# EAGLE design Lora GPS Shield v1.3 (EAGLE 7.5.0)

## Sheet 1 of 2
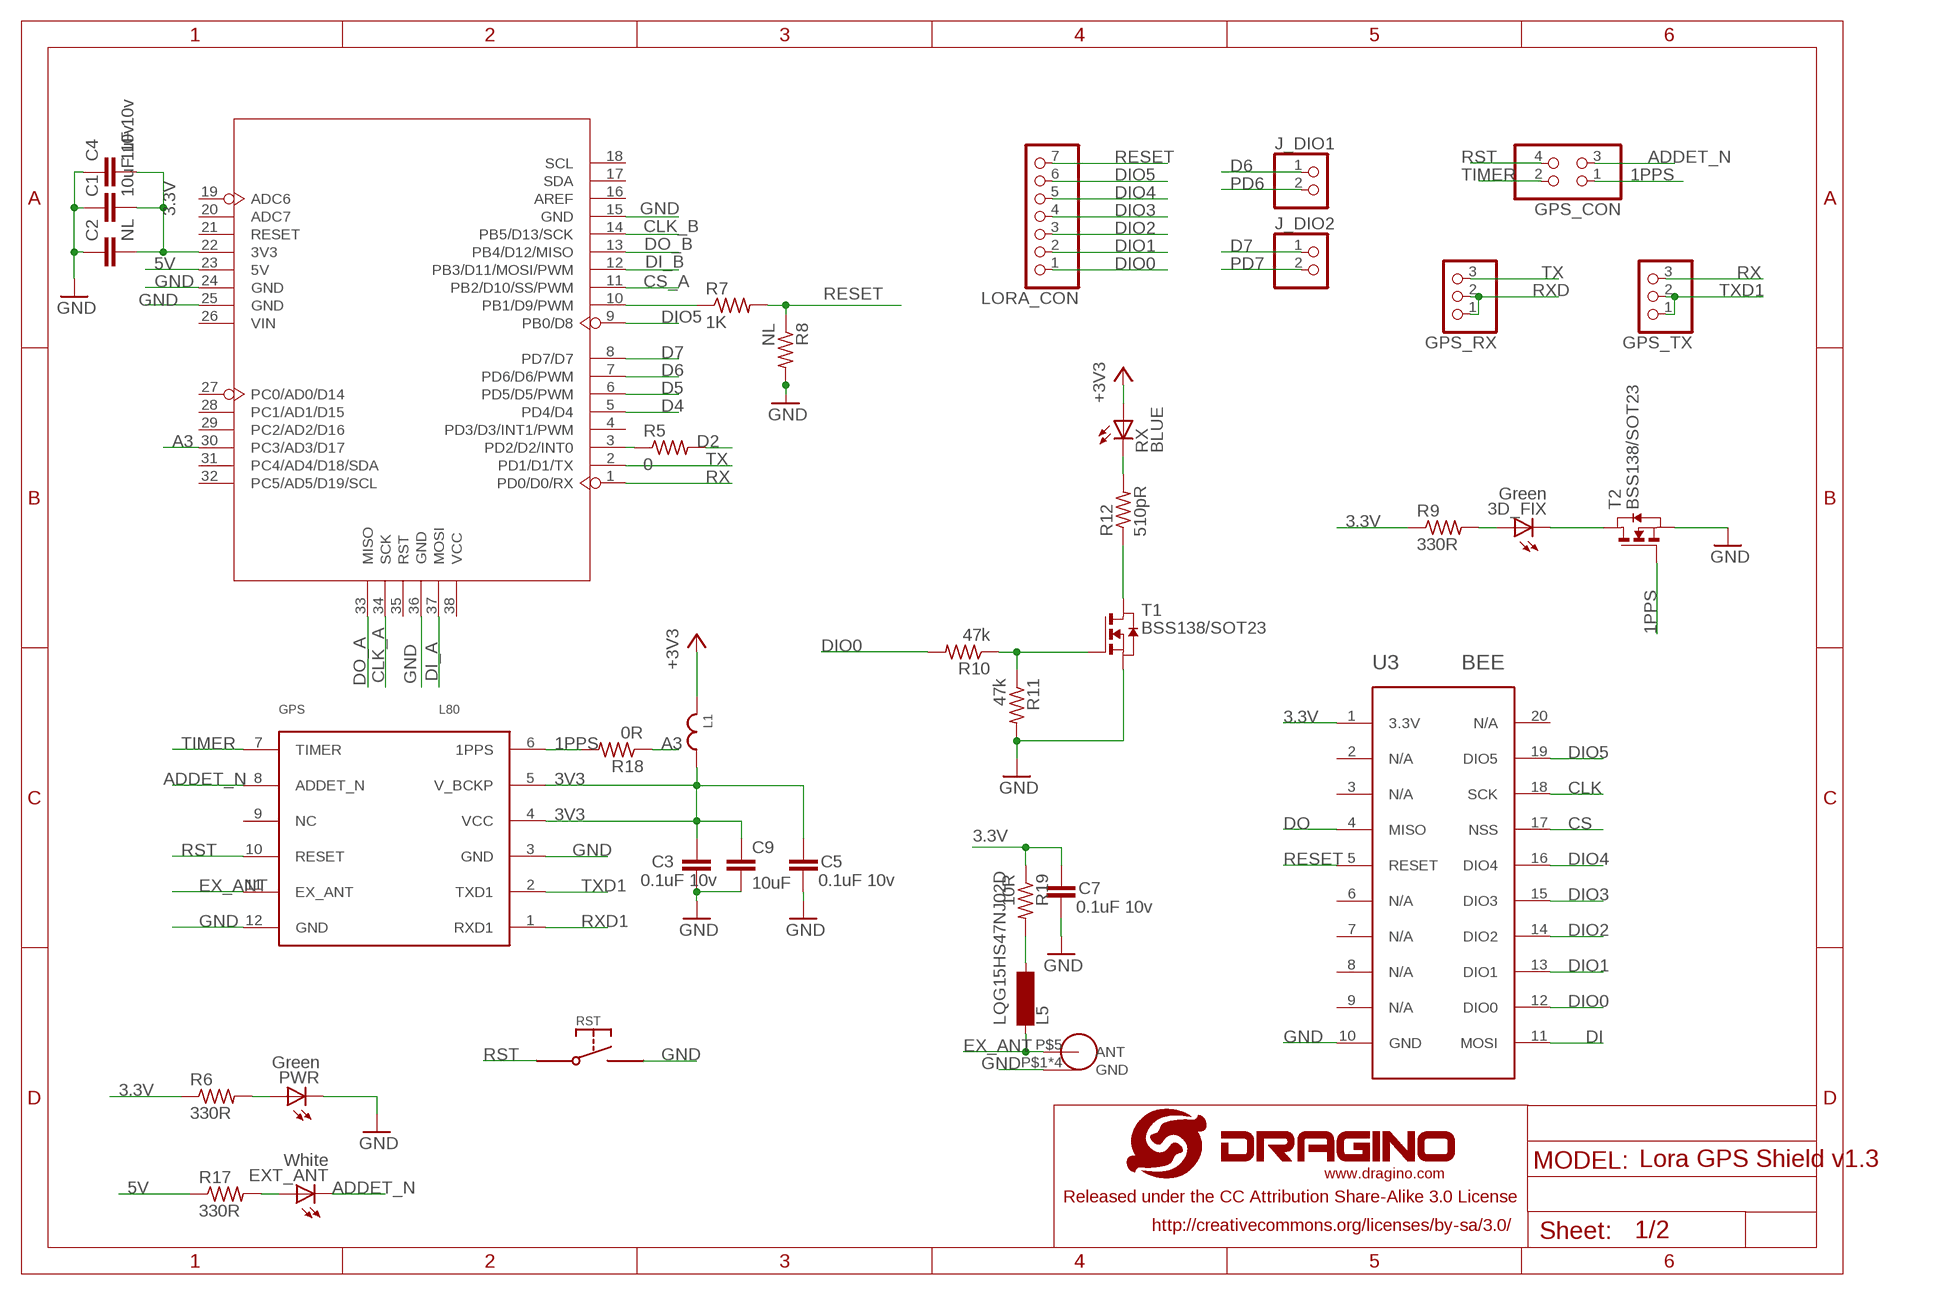
[diagram p0: schematic, sheet 1]

### Parts
3D_FIX  Green  LEDCHIPLED_0603  [CHIPLED_0603]
C1  10uF 10v  C-EUC0805  [C0805]
C2  NL  C-EUC0402  [C0402]
C3  0.1uF 10v  C-EUC0402  [C0402]
C4  1uF 10v  C-EUC0402  [C0402]
C5  0.1uF 10v  C-EUC0402  [C0402]
C7  0.1uF 10v  C-EUC0402  [C0402]
C9  10uF  C-EUC0805  [C0805]
EXT_ANT  White  DRAGINO_LEDCHIPLED_0603  [DRAGINO_CHIPLED_0603]
GPS  L80  [L80]
GPS_ANT  NL  SMA-KE  [SMA-KE]
GPS_CON  PINHD-2X2  [2X02]
GPS_RX  PINHD-1X3  [1X03]
GPS_TX  PINHD-1X3  [1X03]
J_DIO1  PINHD-1X21X2_S  [1X02]
J_DIO2  PINHD-1X2  [1X02]
L1  JLC-PZ2012D800-3R0TF  BEADS0805  [C0805]
L5  LQG15HS47NJ02D  L  [L-0402]
LORA_CON  PINHD-1X71X7_S  [1X07]
PWR  Green  DRAGINO_LEDCHIPLED_0603  [DRAGINO_CHIPLED_0603]
R5  0  R-US_R0402  [R0402]
R6  330R  R-US_R0402  [R0402]
R7  1K  R-US_R0402  [R0402]
R8  NL  R-US_R0402  [R0402]
R9  330R  R-US_R0402  [R0402]
R10  47k  R-US_R0402  [R0402]
R11  47k  R-US_R0402  [R0402]
R12  510pR  R-US_R0402  [R0402]
R17  330R  R-US_R0402  [R0402]
R18  0R  R-US_M0805  [M0805]
R19  10R  R-US_R0402  [R0402]
RST  SWITCHTS-017  [TS-017]
RX  BLUE  LEDCHIPLED_0603  [CHIPLED_0603]
T1  BSS138/SOT23  NMOSFET-SOT23  [SOT-23]
T2  BSS138/SOT23  NMOSFET-SOT23  [SOT-23]
U3  BEE  LORAHAT_S  [LORA]
U5  MOUDLE_ARDUINO-38PMOUDLE_ARDUINO-38P_L  [MOUDLE_ARDUINO-38P_L]
U$1  LOGO-NEW  [LOGO-SILK-NEW]

### Nets
1PPS: GPS.6(1PPS) GPS_CON.1 R18.2 T2.3(G)
3.3V: C1.2 C2.2 C4.2 C7.2 L1.1 R6.1 R9.1 R19.1 RX.A U3.1(3.3V) U5.22(3V3) ; supply symbol labelled +3V3 ; also sheet 2
3V3: C3.2 C5.2 C9.1 GPS.4(VCC) GPS.5(V_BCKP) L1.2
5V: R17.1 U5.23(5V)
/RESET: R12.1 T1.1(D)
A3: R18.1 U5.30(PC3/AD3/D17)
ADDET_N: EXT_ANT.C GPS.8(ADDET_N) GPS_CON.3
CLK: U3.18(SCK) ; also sheet 2
CLK_A: U5.34(SCK) ; also sheet 2
CLK_B: U5.14(PB5/D13/SCK) ; also sheet 2
CS: U3.17(NSS) ; also sheet 2
CS_A: U5.11(PB2/D10/SS/PWM) ; also sheet 2
D2: R5.2 ; also sheet 2
D4: U5.5(PD4/D4) ; also sheet 2
D5: U5.6(PD5/D5/PWM) ; also sheet 2
D6: J_DIO1.1 U5.7(PD6/D6/PWM)
D7: J_DIO2.1 U5.8(PD7/D7)
DI: U3.11(MOSI) ; also sheet 2
DI_A: U5.37(MOSI) ; also sheet 2
DI_B: U5.12(PB3/D11/MOSI/PWM) ; also sheet 2
DIO0: LORA_CON.1 R10.2 U3.12(DIO0) ; also sheet 2
DIO1: LORA_CON.2 U3.13(DIO1) ; also sheet 2
DIO2: LORA_CON.3 U3.14(DIO2) ; also sheet 2
DIO3: LORA_CON.4 U3.15(DIO3)
DIO4: LORA_CON.5 U3.16(DIO4)
DIO5: LORA_CON.6 U3.19(DIO5) U5.9(PB0/D8)
DO: U3.4(MISO) ; also sheet 2
DO_A: U5.33(MISO) ; also sheet 2
DO_B: U5.13(PB4/D12/MISO) ; also sheet 2
EX_ANT: GPS.11(EX_ANT) GPS_ANT.P$5(ANT) L5.1
GND: C1.1 C2.1 C3.1 C4.1 C5.1 C7.1 C9.2 GPS.3(GND) GPS.12(GND) GPS_ANT.P$1(GND) GPS_ANT.P$2(GND) GPS_ANT.P$3(GND) GPS_ANT.P$4(GND) PWR.C R8.2 R11.2 RST.P$2 T1.2(S) T2.2(S) U3.10(GND) U5.15(GND) U5.24(GND) U5.25(GND) U5.36(GND) ; also sheet 2
N$1: R5.1 U5.3(PD2/D2/INT0)
N$6: PWR.A R6.2
N$7: R7.1 U5.10(PB1/D9/PWM)
N$8: 3D_FIX.A R9.2
N$9: 3D_FIX.C T2.1(D)
N$10: R10.1 R11.1 T1.3(G)
N$13: EXT_ANT.A R17.2
N$15: L5.2 R19.2
N$60: R12.2 RX.C
PD6: J_DIO1.2 ; also sheet 2
PD7: J_DIO2.2 ; also sheet 2
RESET: LORA_CON.7 R7.2 R8.1 U3.5(RESET)
RST: GPS.10(RESET) GPS_CON.4 RST.P$1
RX: GPS_TX.3 U5.1(PD0/D0/RX)
RXD: GPS_RX.1 GPS_RX.2 ; also sheet 2
RXD1: GPS.1(RXD1) ; also sheet 2
TIMER: GPS.7(TIMER) GPS_CON.2
TX: GPS_RX.3 U5.2(PD1/D1/TX)
TXD1: GPS.2(TXD1) GPS_TX.1 GPS_TX.2
Unconnected: GPS.9(NC) U3.2(N/A) U3.3(N/A) U3.6(N/A) U3.7(N/A) U3.8(N/A) U3.9(N/A) U3.20(N/A) U5.4(PD3/D3/INT1/PWM) U5.16(AREF) U5.17(SDA) U5.18(SCL) U5.19(ADC6) U5.20(ADC7) U5.21(RESET) U5.26(VIN) U5.27(PC0/AD0/D14) U5.28(PC1/AD1/D15) U5.29(PC2/AD2/D16) U5.31(PC4/AD4/D18/SDA) U5.32(PC5/AD5/D19/SCL) U5.35(RST) U5.38(VCC)

## Sheet 2 of 2
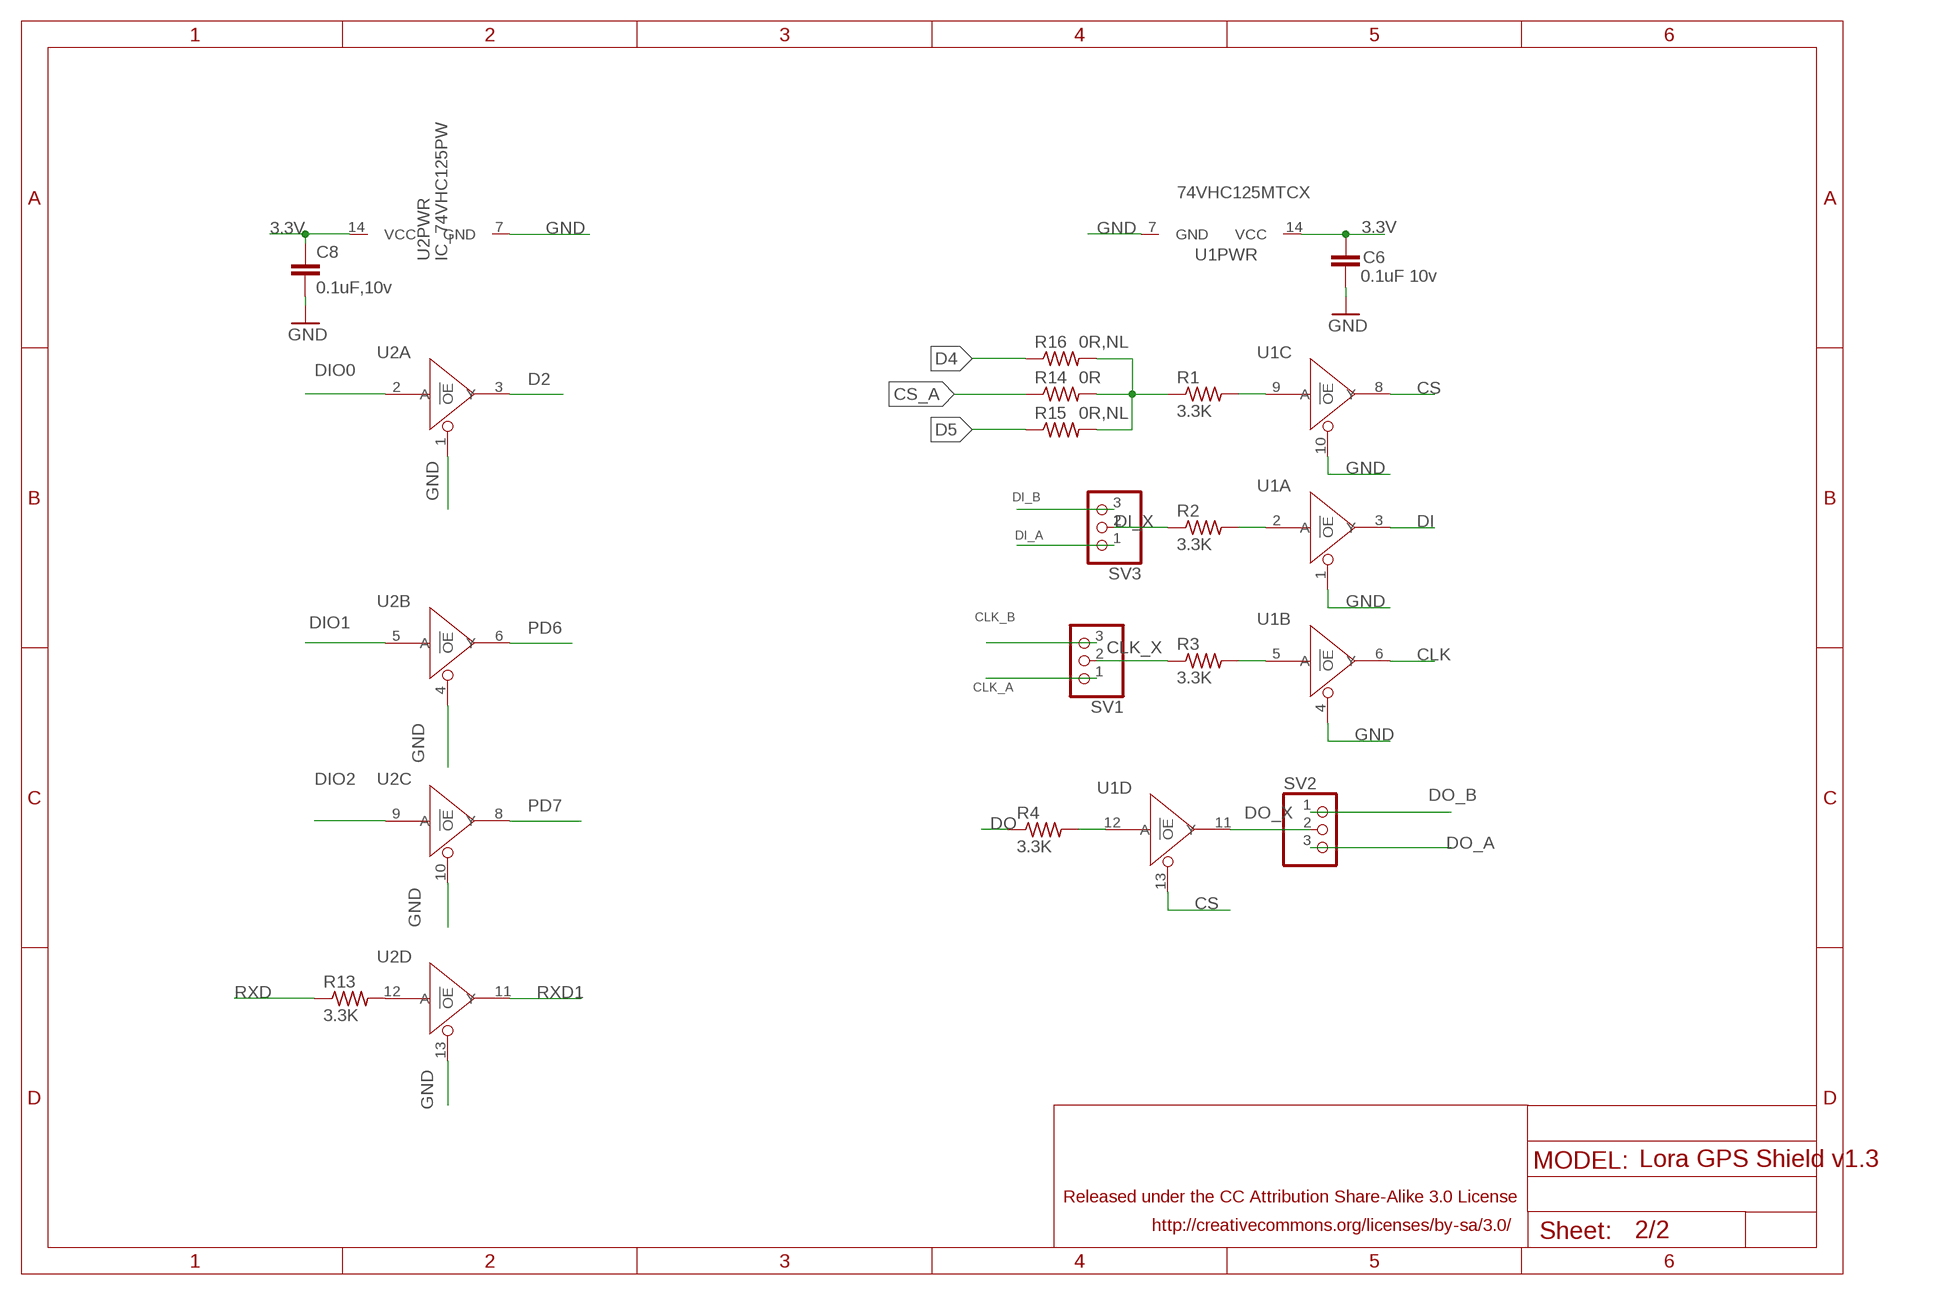
[diagram p1: schematic, sheet 2]

### Parts
C6  0.1uF 10v  C-EUC0402  [C0402]
C8  0.1uF,10v  C-EUC0402  [C0402]
R1  3.3K  R-US_R0402  [R0402]
R2  3.3K  R-US_R0402  [R0402]
R3  3.3K  R-US_R0402  [R0402]
R4  3.3K  R-US_R0402  [R0402]
R13  3.3K  R-US_R0402  [R0402]
R14  0R  R-US_R0603  [R0603]
R15  0R,NL  R-US_R0603  [R0603]
R16  0R,NL  R-US_R0603  [R0603]
SV1  PINHD-1X31X3_S  [1X03]
SV2  PINHD-1X3  [1X03]
SV3  PINHD-1X3  [1X03]
U1  74VHC125MTCX  74VHC125PW  [TSSOP14]
U2  IC_74VHC125PW  [IC_TSSOP14]

### Nets
3.3V: C6.2 C8.1 U1.14(PWR:VCC) U2.14(PWR:VCC) ; also sheet 1
CLK: U1.6(B:Y) ; also sheet 1
CLK_A: SV1.1 ; also sheet 1
CLK_B: SV1.3 ; also sheet 1
CLK_X: R3.1 SV1.2
CS: U1.8(C:Y) U1.13(D:!OE) ; also sheet 1
CS_A: R14.1 ; also sheet 1
D2: U2.3(A:Y) ; also sheet 1
D4: R16.1 ; also sheet 1
D5: R15.1 ; also sheet 1
DI: U1.3(A:Y) ; also sheet 1
DI_A: SV3.1 ; also sheet 1
DI_B: SV3.3 ; also sheet 1
DI_X: R2.1 SV3.2
DIO0: U2.2(A:A) ; also sheet 1
DIO1: U2.5(B:A) ; also sheet 1
DIO2: U2.9(C:A) ; also sheet 1
DO: R4.1 ; also sheet 1
DO_A: SV2.3 ; also sheet 1
DO_B: SV2.1 ; also sheet 1
DO_X: SV2.2 U1.11(D:Y)
GND: C6.1 C8.2 U1.1(A:!OE) U1.4(B:!OE) U1.7(PWR:GND) U1.10(C:!OE) U2.1(A:!OE) U2.4(B:!OE) U2.7(PWR:GND) U2.10(C:!OE) U2.13(D:!OE) ; also sheet 1
N$2: R4.2 U1.12(D:A)
N$3: R3.2 U1.5(B:A)
N$4: R2.2 U1.2(A:A)
N$5: R1.2 U1.9(C:A)
N$11: R13.2 U2.12(D:A)
N$12: R1.1 R14.2 R15.2 R16.2
PD6: U2.6(B:Y) ; also sheet 1
PD7: U2.8(C:Y) ; also sheet 1
RXD: R13.1 ; also sheet 1
RXD1: U2.11(D:Y) ; also sheet 1

## Library data of the parts
3D_FIX = dragino:LED: LED OSRAM: - CHIPLED LG R971, LG N971, LY N971, LG Q971, LY Q971, LO R971, LY R971 LH N974, LH R974 LS Q976, LO Q976, LY Q976 LO Q996 - Hyper CHIPLED LW Q18S LB Q993, LB Q99A, LB R99A - SideLED LS A670, LO A670, LY A670, LG A670, LP A670 LB A673, LV A673, LT A673, LW A673 LH A674 LY A675 LS A676, LA A676, LO A676, LY A676, LW A676 LS A679, LY A679, LG A679 - Hyper Micro SIDELED® LS Y876, LA Y876, LO Y876, LY Y876 LT Y87S - SmartLED LW L88C, LW L88S LB L89C, LB L89S, LG L890 LS L89K, LO L89K, LY L89K LS L896, LA L896, LO L896, LY L896 - TOPLED LS T670, LO T670, LY T670, LG T670, LP T670 LSG T670, LSP T670, LSY T670, LOP T670, LYG T670 LG T671, LOG T671, LSG T671 LB T673, LV T673, LT T673, LW T673 LH T674 LS T676, LA T676, LO T676, LY T676, LB T676, LH T676, LSB T676, LW T676 LB T67C, LV T67C, LT T67C, LS T67K, LO T67K, LY T67K, LW E67C LS E67B, LA E67B, LO E67B, LY E67B, LB E67C, LV E67C, LT E67C LW T67C LS T679, LY T679, LG T679 LS T770, LO T770, LY T770, LG T770, LP T770 LB T773, LV T773, LT T773, LW T773 LH T774 LS E675, LA E675, LY E675, LS T675 LS T776, LA T776, LO T776, LY T776, LB T776 LHGB T686 LT T68C, LB T68C - Hyper Mini TOPLED® LB M676 - Mini TOPLED Santana® LG M470 LS M47K, LO M47K, LY M47K Source: http://www.osram.convergy.de LUXEON: - LUMILED® LXK2-PW12-R00, LXK2-PW12-S00, LXK2-PW14-U00, LXK2-PW14-V00 LXK2-PM12-R00, LXK2-PM12-S00, LXK2-PM14-U00 LXK2-PE12-Q00, LXK2-PE12-R00, LXK2-PE12-S00, LXK2-PE14-T00, LXK2-PE14-U00 LXK2-PB12-K00, LXK2-PB12-L00, LXK2-PB12-M00, LXK2-PB14-N00, LXK2-PB14-P00, LXK2-PB14-Q00 LXK2-PR12-L00, LXK2-PR12-M00, LXK2-PR14-Q00, LXK2-PR14-R00 LXK2-PD12-Q00, LXK2-PD12-R00, LXK2-PD12-S00 LXK2-PH12-R00, LXK2-PH12-S00 LXK2-PL12-P00, LXK2-PL12-Q00, LXK2-PL12-R00 Source: www.luxeon.com KINGBRIGHT: KA-3528ASYC Source: www.kingbright.com
C1-C9 = dragino-passive:C-EU: CAPACITOR, European symbol
EXT_ANT PWR = Lora Shield v1.1.1:DRAGINO_LED: LED OSRAM: - CHIPLED LG R971, LG N971, LY N971, LG Q971, LY Q971, LO R971, LY R971 LH N974, LH R974 LS Q976, LO Q976, LY Q976 LO Q996 - Hyper CHIPLED LW Q18S LB Q993, LB Q99A, LB R99A - SideLED LS A670, LO A670, LY A670, LG A670, LP A670 LB A673, LV A673, LT A673, LW A673 LH A674 LY A675 LS A676, LA A676, LO A676, LY A676, LW A676 LS A679, LY A679, LG A679 - Hyper Micro SIDELED? LS Y876, LA Y876, LO Y876, LY Y876 LT Y87S - SmartLED LW L88C, LW L88S LB L89C, LB L89S, LG L890 LS L89K, LO L89K, LY L89K LS L896, LA L896, LO L896, LY L896 - TOPLED LS T670, LO T670, LY T670, LG T670, LP T670 LSG T670, LSP T670, LSY T670, LOP T670, LYG T670 LG T671, LOG T671, LSG T671 LB T673, LV T673, LT T673, LW T673 LH T674 LS T676, LA T676, LO T676, LY T676, LB T676, LH T676, LSB T676, LW T676 LB T67C, LV T67C, LT T67C, LS T67K, LO T67K, LY T67K, LW E67C LS E67B, LA E67B, LO E67B, LY E67B, LB E67C, LV E67C, LT E67C LW T67C LS T679, LY T679, LG T679 LS T770, LO T770, LY T770, LG T770, LP T770 LB T773, LV T773, LT T773, LW T773 LH T774 LS E675, LA E675, LY E675, LS T675 LS T776, LA T776, LO T776, LY T776, LB T776 LHGB T686 LT T68C, LB T68C - Hyper Mini TOPLED? LB M676 - Mini TOPLED Santana? LG M470 LS M47K, LO M47K, LY M47K Source: http://www.osram.convergy.de LUXEON: - LUMILED? LXK2-PW12-R00, LXK2-PW12-S00, LXK2-PW14-U00, LXK2-PW14-V00 LXK2-PM12-R00, LXK2-PM12-S00, LXK2-PM14-U00 LXK2-PE12-Q00, LXK2-PE12-R00, LXK2-PE12-S00, LXK2-PE14-T00, LXK2-PE14-U00 LXK2-PB12-K00, LXK2-PB12-L00, LXK2-PB12-M00, LXK2-PB14-N00, LXK2-PB14-P00, LXK2-PB14-Q00 LXK2-PR12-L00, LXK2-PR12-M00, LXK2-PR14-Q00, LXK2-PR14-R00 LXK2-PD12-Q00, LXK2-PD12-R00, LXK2-PD12-S00 LXK2-PH12-R00, LXK2-PH12-S00 LXK2-PL12-P00, LXK2-PL12-Q00, LXK2-PL12-R00 Source: www.luxeon.com KINGBRIGHT: KA-3528ASYC Source: www.kingbright.com
GPS = L80:L80
GPS_ANT = sma-ke:SMA-KE
GPS_CON = pinhead:PINHD-2X2: PIN HEADER
GPS_RX GPS_TX SV1-SV3 = pinhead:PINHD-1X3: PIN HEADER
J_DIO1 J_DIO2 = pinhead:PINHD-1X2: PIN HEADER
L1 = dragino:BEADS
L5 = inductor-neosid:L
LORA_CON = pinhead:PINHD-1X7: PIN HEADER
R1-R19 = dragino:R-US_: RESISTOR, American symbol
RST = dragino:SWITCH
RX = dragino-passive:LED: LED OSRAM: - CHIPLED LG R971, LG N971, LY N971, LG Q971, LY Q971, LO R971, LY R971 LH N974, LH R974 LS Q976, LO Q976, LY Q976 LO Q996 - Hyper CHIPLED LW Q18S LB Q993, LB Q99A, LB R99A - SideLED LS A670, LO A670, LY A670, LG A670, LP A670 LB A673, LV A673, LT A673, LW A673 LH A674 LY A675 LS A676, LA A676, LO A676, LY A676, LW A676 LS A679, LY A679, LG A679 - Hyper Micro SIDELED® LS Y876, LA Y876, LO Y876, LY Y876 LT Y87S - SmartLED LW L88C, LW L88S LB L89C, LB L89S, LG L890 LS L89K, LO L89K, LY L89K LS L896, LA L896, LO L896, LY L896 - TOPLED LS T670, LO T670, LY T670, LG T670, LP T670 LSG T670, LSP T670, LSY T670, LOP T670, LYG T670 LG T671, LOG T671, LSG T671 LB T673, LV T673, LT T673, LW T673 LH T674 LS T676, LA T676, LO T676, LY T676, LB T676, LH T676, LSB T676, LW T676 LB T67C, LV T67C, LT T67C, LS T67K, LO T67K, LY T67K, LW E67C LS E67B, LA E67B, LO E67B, LY E67B, LB E67C, LV E67C, LT E67C LW T67C LS T679, LY T679, LG T679 LS T770, LO T770, LY T770, LG T770, LP T770 LB T773, LV T773, LT T773, LW T773 LH T774 LS E675, LA E675, LY E675, LS T675 LS T776, LA T776, LO T776, LY T776, LB T776 LHGB T686 LT T68C, LB T68C - Hyper Mini TOPLED® LB M676 - Mini TOPLED Santana® LG M470 LS M47K, LO M47K, LY M47K Source: http://www.osram.convergy.de LUXEON: - LUMILED® LXK2-PW12-R00, LXK2-PW12-S00, LXK2-PW14-U00, LXK2-PW14-V00 LXK2-PM12-R00, LXK2-PM12-S00, LXK2-PM14-U00 LXK2-PE12-Q00, LXK2-PE12-R00, LXK2-PE12-S00, LXK2-PE14-T00, LXK2-PE14-U00 LXK2-PB12-K00, LXK2-PB12-L00, LXK2-PB12-M00, LXK2-PB14-N00, LXK2-PB14-P00, LXK2-PB14-Q00 LXK2-PR12-L00, LXK2-PR12-M00, LXK2-PR14-Q00, LXK2-PR14-R00 LXK2-PD12-Q00, LXK2-PD12-R00, LXK2-PD12-S00 LXK2-PH12-R00, LXK2-PH12-S00 LXK2-PL12-P00, LXK2-PL12-Q00, LXK2-PL12-R00 Source: www.luxeon.com KINGBRIGHT: KA-3528ASYC Source: www.kingbright.com
T1 T2 = dragino:NMOSFET-SOT23: MOS FET; OC_FARNELL: unknown; OC_NEWARK: unknown
U1 = IC:74V*125: Quad Buffer/Line Driver;3-state
U2 = Lora Shield v1.1.1:IC_74V*125: Quad Buffer/Line Driver;3-state
U3 = dragino:LORAHAT
U5 = board_arduino:MOUDLE_ARDUINO-38P
U$1 = dragino:LOGO-NEW

## Net classes
0 default: width 0.203 mm, clearance 0.152 mm
2 gnd: width 0.305 mm, drill 0.33 mm, clearance 0.254 mm

## Board
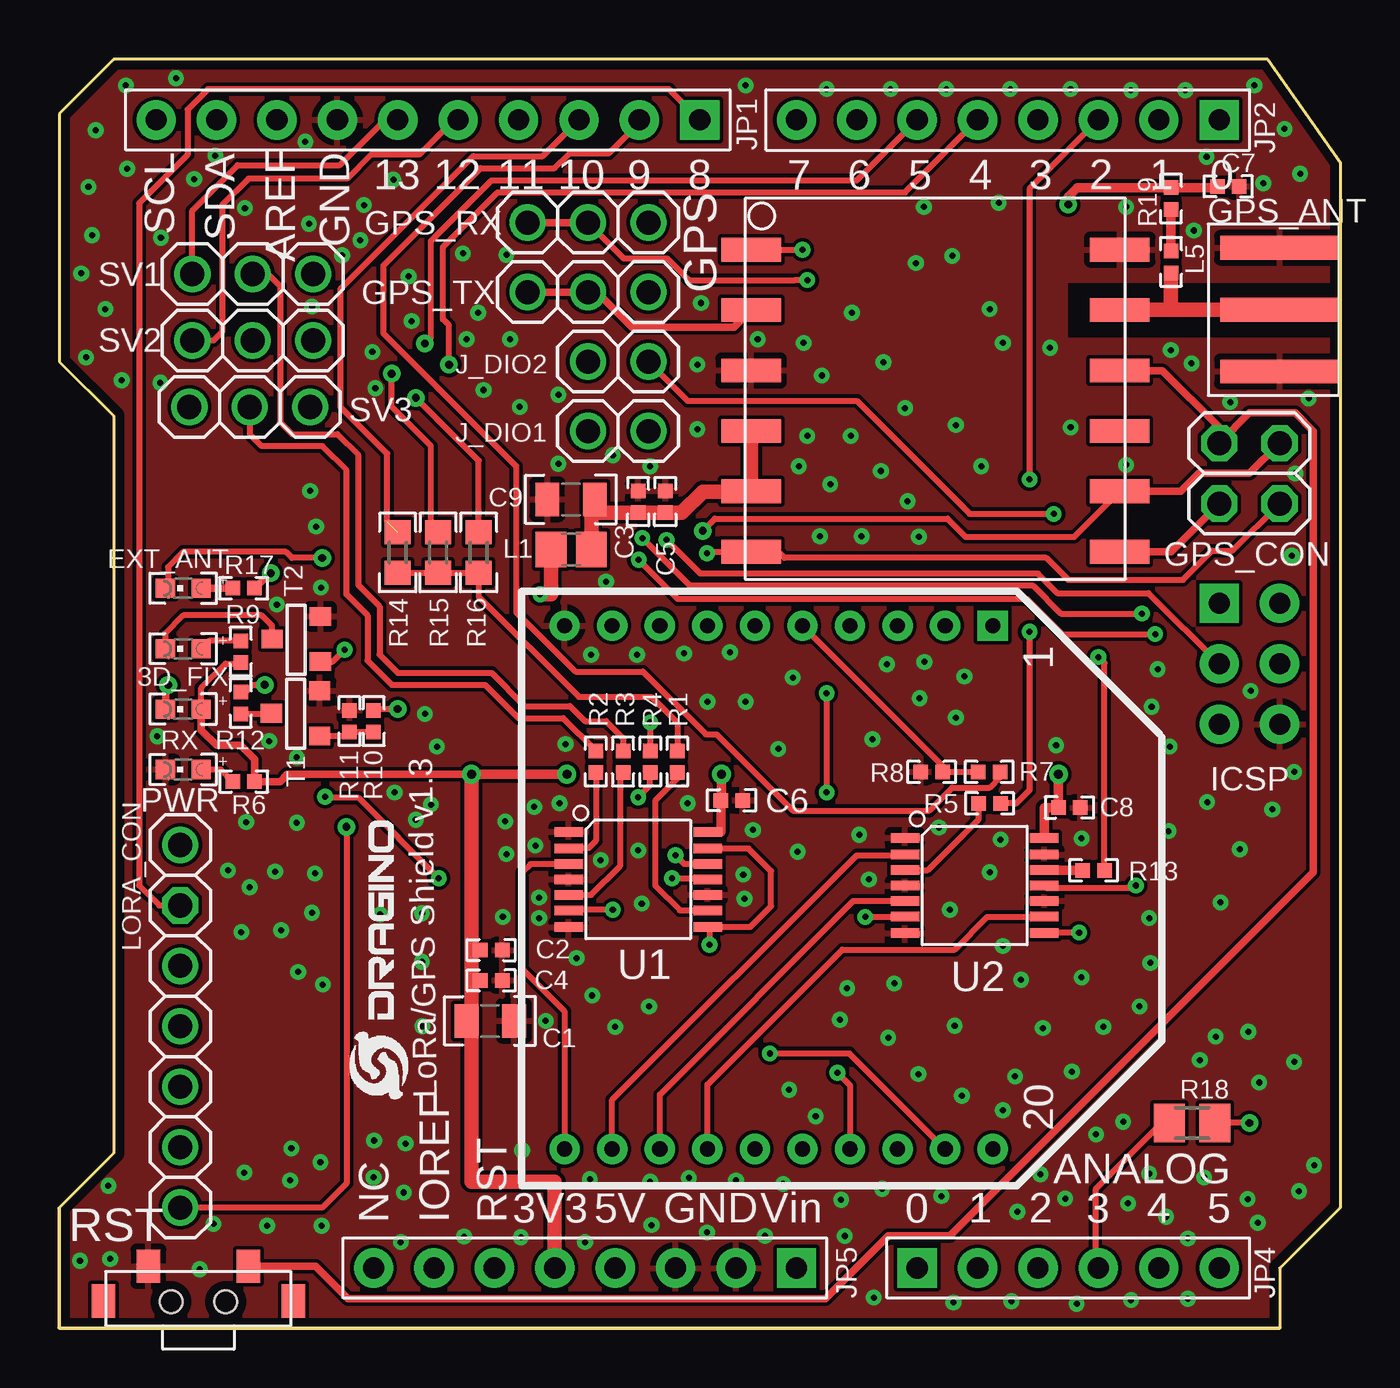
[diagram p2: board, top side]
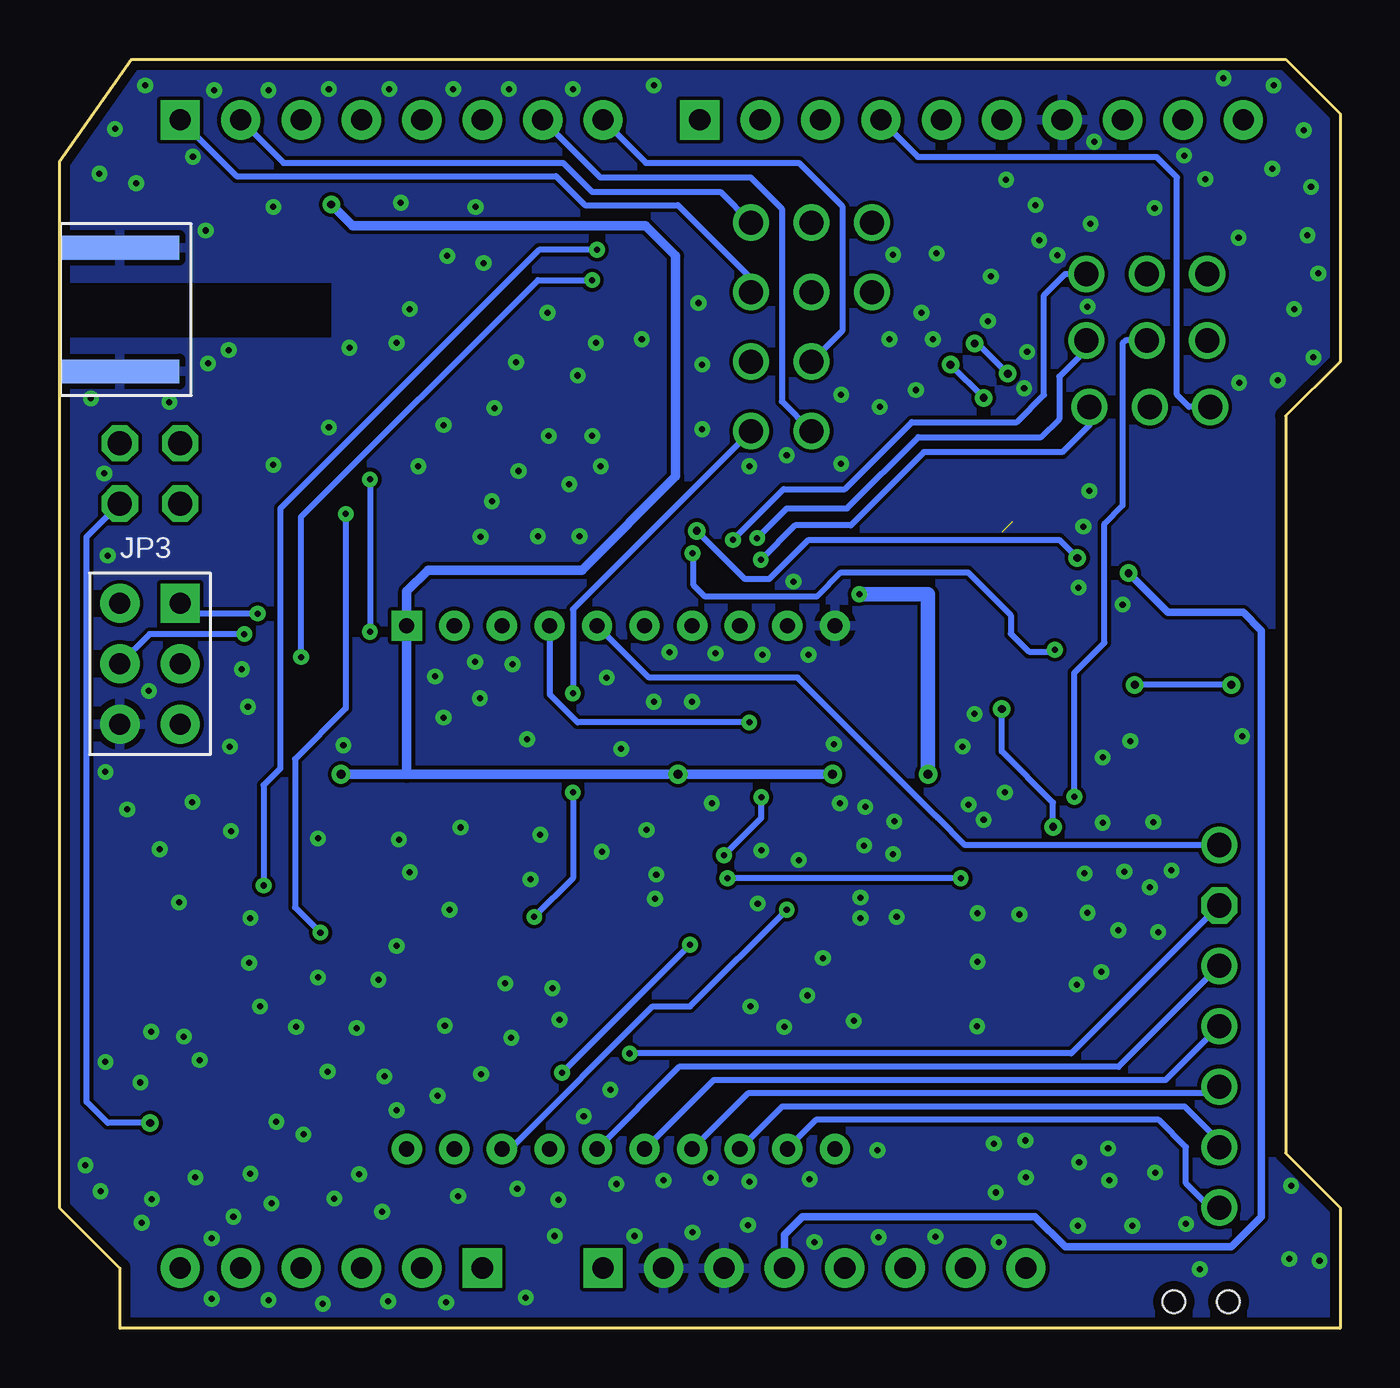
[diagram p3: board, bottom side, seen from below]

Size 53.85 x 53.34 mm. Coordinates in mm from the lower left corner, seen from the top.
Copper layers (1*16): Top 0.035mm / dielectric 1.5mm / Bottom 0.035mm
Design rules "default *": minimum track width 10mil, minimum drill 10mil, track to track 6mil, track to pad 6mil, pad to pad 6mil, via to via 6mil, smd to smd 6mil, copper to edge 15mil, drill to drill 6mil, minimum pad ring 10mil, minimum via ring 8mil, stop-mask expansion 4mil, vias tented up to drill 30mil, thermal gap 10mil
tRestrict: area 42.4,41.7 to 53.7,43.9
bRestrict: area 42.4,41.7 to 53.7,43.9

### Footprints (pad centres in the part's own frame; a part is rotated, then mirrored left to right if it is on the bottom)
CHIPLED_0603 = smd 0.8 x 0.8: A 0,-0.75; C 0,0.75
C0805 = smd 1 x 1.4: 1 -1,0; 2 1,0
C0402 = smd 0.61 x 0.61: 1 -0.457,0; 2 0.457,0
DRAGINO_CHIPLED_0603 = smd 0.8 x 0.8: A 0,-0.75; C 0,0.75
L80 = smd 2.5 x 1: 1 -7.75,5.85; 2 -7.75,3.31; 3 -7.75,0.77; 4 -7.75,-1.77; 5 -7.75,-4.31; 6 -7.75,-6.85; 7 7.75,-6.85; 8 7.75,-4.31; 9 7.75,-1.77; 10 7.75,0.77; 11 7.75,3.31; 12 7.75,5.85
SMA-KE = smd 1 x 5: P$1 -2.6,0; P$2 2.6,0; P$5 0,0 | smd 1 x 5 bottom: P$3 -2.6,0; P$4 2.6,0
2X02 = drill 1.016 octagon: 1 -1.27,-1.27; 2 -1.27,1.27; 3 1.27,-1.27; 4 1.27,1.27
1X03 = drill 1.016: 1 -2.54,0; 2 0,0; 3 2.54,0
1X02 = drill 1.016: 1 -1.27,0; 2 1.27,0
C0805' = smd 1.3 x 1.5: 1 -0.85,0; 2 0.85,0
L-0402 = smd 0.61 x 0.61: 1 -0.457,0; 2 0.457,0
1X07 = drill 1.016: 1 -7.62,0; 2 -5.08,0; 3 -2.54,0; 4 0,0; 5 2.54,0; 7 7.62,0 | drill 1.016 octagon: 6 5.08,0
R0402 = smd 0.61 x 0.61: 1 -0.457,0; 2 0.457,0
R0603 = smd 1 x 1.1: 1 -0.85,0; 2 0.85,0
M0805 = smd 1.3 x 1.6: 1 -0.95,0; 2 0.95,0
TS-017 = smd 1 x 1.4: P$1 -2.1,-1.5; P$2 2.1,-1.5; P$3 -3.994,-0.034; P$4 3.994,-0.034 | hole 0.95: -1.15,0; 1.15,0
SOT-23 = smd 0.787 x 0.889: 1 0,-1.016; 2 -0.95,1.016; 3 0.95,1.016
TSSOP14 = smd 0.4 x 1.2: 1 -2,-2.925; 2 -1.3,-2.925; 3 -0.65,-2.925; 4 0,-2.925; 5 0.65,-2.925; 6 1.3,-2.925; 7 2,-2.925; 8 2,2.925; 9 1.3,2.925; 10 0.65,2.925; 11 0,2.925; 12 -0.65,2.925; 13 -1.3,2.925; 14 -2,2.925
IC_TSSOP14 = smd 0.4 x 1.2: 1 -2,-2.925; 2 -1.3,-2.925; 3 -0.65,-2.925; 4 0,-2.925; 5 0.65,-2.925; 6 1.3,-2.925; 7 2,-2.925; 8 2,2.925; 9 1.3,2.925; 10 0.65,2.925; 11 0,2.925; 12 -0.65,2.925; 13 -1.3,2.925; 14 -2,2.925
LORA = drill 0.635 pad 1.27 square: 1 -11,7.62 | drill 0.635 pad 1.27: 2 -11,5.62; 3 -11,3.62; 4 -11,1.62; 5 -11,-0.38; 6 -11,-2.38; 7 -11,-4.38; 8 -11,-6.38; 9 -11,-8.38; 10 -11,-10.38; 11 11,-10.38; 12 11,-8.38; 13 11,-6.38; 14 11,-4.38; 15 11,-2.38; 16 11,-0.38; 17 11,1.62; 18 11,3.62; 19 11,5.62; 20 11,7.62
MOUDLE_ARDUINO-38P_L = drill 0.889 pad 1.651 square: 1 21.59,22.86; 9 -0.254,22.86; 26 3.81,-25.4; 27 8.89,-25.4; 33 21.59,2.54 | drill 0.889 pad 1.651: 2 19.05,22.86; 3 16.51,22.86; 4 13.97,22.86; 5 11.43,22.86; 6 8.89,22.86; 7 6.35,22.86; 8 3.81,22.86; 10 -2.794,22.86; 11 -5.334,22.86; 12 -7.874,22.86; 13 -10.414,22.86; 14 -12.954,22.86; 15 -15.494,22.86; 16 -18.034,22.86; 17 -20.574,22.86; 18 -23.114,22.86; 19 -13.97,-25.4; 20 -11.43,-25.4; 21 -8.89,-25.4; 22 -6.35,-25.4; 23 -3.81,-25.4; 24 -1.27,-25.4; 25 1.27,-25.4; 28 11.43,-25.4; 29 13.97,-25.4; 30 16.51,-25.4; 31 19.05,-25.4; 32 21.59,-25.4; 34 21.59,0; 35 21.59,-2.54; 36 24.13,-2.54; 37 24.13,0; 38 24.13,2.54

### Placement (x,y rotation side)
3D_FIX  5.21,28.58 90 top
C1  18.11,12.93 180 top
C2  18.16,15.9 180 top
C3  24.33,34.75 270 top
C4  18.16,14.63 180 top
C5  25.48,34.75 270 top
C6  28.27,22.2 180 top
C7  49.15,48.01 180 top
C8  42.47,21.89 0 top
C9  21.51,34.85 180 top
EXT_ANT  5.21,31.12 90 top
GPS  36.83,39.5 0 top
GPS_ANT  51.31,42.82 90 top
GPS_CON  50.04,35.94 90 top
GPS_RX  22.22,46.48 0 top
GPS_TX  22.22,43.56 0 top
J_DIO1  23.49,37.72 0 top
J_DIO2  23.49,40.64 0 top
L1  JLC-PZ2012D800-3R0TF  [C0805']  21.51,32.74 0 top
L5  46.74,44.83 90 top
LORA_CON  5.08,12.7 90 top
PWR  5.21,23.5 90 top
R1  25.98,23.83 270 top
R2  22.56,23.83 270 top
R3  23.7,23.83 270 top
R4  24.84,23.83 270 top
R5  39.12,22.07 180 top
R6  7.75,22.99 180 top
R7  39.09,23.39 180 top
R8  36.68,23.39 180 top
R9  7.62,28.45 90 top
R10  13.21,25.53 90 top
R11  12.19,25.53 90 top
R12  7.62,26.29 90 top
R13  43.48,19.25 180 top
R14  14.22,32.61 270 top
R15  15.93,32.61 270 top
R16  17.63,32.61 270 top
R17  7.75,31.12 180 top
R18  47.62,8.64 0 top
R19  46.74,47.5 270 top
RST  5.84,1.12 180 top
RX  5.21,26.04 90 top
SV1  8.13,44.32 180 top
SV2  8.13,41.53 0 top
SV3  8,38.73 180 top
T1  9.93,25.86 270 top
T2  9.96,28.98 270 top
U1  24.33,18.87 270 top
U2  38.48,18.62 270 top
U3  31.62,18.54 270 top
U5  27.18,27.94 0 top
U$1  14.66,9.63 90 top

### Tracks (layer width: path | path; a pad name or v marks a point on that pad's centre or on a via)
1PPS  (via drill 0.25, 0.33)
  Top 0.254: v27.23,32.59 27.29,32.65 GPS.6 29.2,32.77 30.1,32.77 30.48,32.38 41.5,32.38 42.42,31.47 47.24,31.47 48.46,32.69 49.33,32.69 GPS_CON.1 | v50.04,8.64 R18.2 | T2.3 11.5,28.03 v11.99,28.52
  Bottom 0.254: v50.04,8.64 51.82,8.64 52.7,9.53 52.7,33.27 GPS_CON.1 | v27.23,32.59 27.18,32.54 27.18,31.24 26.7,30.76 22,30.76 20.98,31.77 15.65,31.77 13.84,29.97 13.84,29.21 13.08,28.45 12.06,28.45 v11.99,28.52
3.3V  (via drill 0.25, 0.33, 0.38)
  Top 0.254: U1.14 27.84,20.87 27.84,22.17 | 17.4,13.01 17.32,12.93 C1.2 | C4.2 17.4,14.63 17.32,14.55 | C2.2 17.45,15.9 17.32,15.77 | 17.26,14.07 17.26,13.07 17.21,13.02 17.02,12.83 | R9.1 7.57,27.94 6.98,27.94 5.97,26.92 5.97,26.15 5.97,26.05 RX.A
  Top 0.305: v17.32,23.29 9.58,23.29 9.27,22.99 R6.1 8.2,23.93 7.62,24.51 6.6,24.51 5.97,25.15 5.97,26.15
  Top 0.406: U2.14 41.41,21.9 C8.1 v42.01,23.29 | C6.2 27.81,20.87 U1.14 | v17.32,23.29 v21.34,23.29 | 27.84,22.17 v27.84,23.29 | 17.32,14.07 17.32,14.55 | C1.2 17.21,12.93 17.21,13.02 | C7.2 48.69,47.95 R19.1 42.8,47.95 42.42,47.57 v42.42,47.24
  Top 0.61: U5.22 20.83,6.17 17.32,6.17 17.32,12.93 17.32,14.55 17.32,15.77 v17.32,23.29 | v20.22,30.86 20.66,30.86 L1.1
  Bottom 0.406: v21.34,23.29 v27.84,23.29 39.24,23.29 | 39.24,23.29 v42.01,23.29 | 39.24,23.29 U3.1 39.24,30.99 38.35,31.88 31.88,31.88 27.94,35.81 27.94,45.09 29.21,46.36 41.53,46.36 v42.42,47.24
  Bottom 0.61: v20.22,30.86 17.32,30.86 v17.32,23.29
3V3
  Top 0.406: C9.1 22.48,34.85 22.48,34.29
  Top 0.61: L1.2 22.36,34.29 22.48,34.29 C3.2 C5.2 26.16,34.29 27.05,35.18 GPS.5 GPS.4
5V  (via drill 0.33)
  Top 0.305: v8.89,31.75 8.84,31.75 R17.1
  Bottom 0.305: U5.23 23.37,3.94 22.61,4.7 12.83,4.7 11.56,3.43 4.57,3.43 3.3,4.7 3.3,29.34 4.06,30.1 7.24,30.1 v8.89,31.75
/RESET
  Top 0.254: R12.1 8.89,25.83 T1.1
A3
  Top 0.254: R18.1 46.35,8.64 43.56,5.84 43.56,2.67 U5.30
ADDET_N  (via drill 0.33)
  Top 0.254: v27.05,33.53 27.56,34.04 37.34,34.04 38.1,33.27 42.67,33.27 GPS.8 | v11.05,32.38 9.78,32.38 9.52,32.64 5.21,32.64 4.57,32 4.57,31.23 EXT_ANT.C
  Top 0.305: GPS.8 47.15,35.19 47.9,35.94 50.04,35.94 GPS_CON.3
  Bottom 0.254: v27.05,33.53 25.02,31.5 24,31.5 22.35,33.15 11.81,33.15 v11.05,32.38
CLK  (via drill 0.25)
  Top 0.254: v23.27,17.6 21.44,17.6 U1.6
  Bottom 0.254: U3.18 34.9,7.54 28.91,13.54 27.33,13.54 v23.27,17.6
CLK_A  (via drill 0.25)
  Top 0.254: U5.34 45.8,30.91 41.96,30.91 41.15,31.73 26.95,31.73 v25.53,33.15
  Bottom 0.254: SV1.1 11.56,44.32 12.45,43.43 12.45,39.24 13.59,38.1 18.01,38.1 20.83,35.28 23.39,35.28 v25.53,33.15
CLK_B
  Top 0.254: U5.14 13.69,50.8 11.79,48.9 7.49,48.9 5.59,46.99 SV1.3
CLK_X
  Top 0.254: R3.1 23.7,24.82 22.99,25.53 22.1,25.53 21.46,26.16 19.56,26.16 18.16,27.56 14.22,27.56 13.46,28.32 13.46,30.35 12.57,31.24 12.57,36.7 11.68,37.59 9.78,37.59 9.27,38.1 9.27,43.82 8.76,44.32 SV1.2
CS  (via drill 0.25)
  Top 0.254: U1.8 27.3,16.87 | U1.13 28.98,20.17 29.92,19.23 29.92,17.76 29.04,16.87 27.3,16.87 | 27.3,16.87 27.28,16.89 | 27.3,16.87 27.33,16.84 v27.33,16.13 | v32.71,10.74 33.24,10.22 U3.17
  Bottom 0.254: v27.33,16.13 v32.71,10.74
CS_A  (1 unrouted)
  Top 0.254: U5.11 20.32,49.28 17.4,49.28 11.81,43.69 11.81,38.73 13.78,36.77 13.78,33.91
D2
  Top 0.254: U2.3 36.52,19.27 38.66,21.41 R5.2
D4  (via drill 0.33)
  Top 0.254: R16.1 17.63,36.47 v14.99,39.12 | v16.38,40.51 16.38,42.16 16.13,42.42 16.13,45.47 18.41,47.75 35.56,47.75 U5.5
  Bottom 0.254: v14.99,39.12 v16.38,40.51
D5  (via drill 0.33)
  Top 0.254: R15.1 15.62,33.77 15.62,37.08 13.97,38.73 v13.97,40.13 | v15.37,41.4 15.62,41.66 15.62,45.72 18.16,48.26 33.53,48.26 U5.6
  Bottom 0.254: v13.97,40.13 15.24,41.4 v15.37,41.4
D6
  Bottom 0.254: U5.7 31.11,48.39 24.79,48.39 23.47,47.07 23.47,38.96 J_DIO1.1
D7
  Bottom 0.254: U5.8 29.18,49 22.76,49 20.93,47.17 20.93,41.94 J_DIO2.1
DI
  Top 0.254: U3.11 21.23,13.34 19.46,15.11 19.46,19.18 19.8,19.52 U1.3
DI_A  (via drill 0.25)
  Top 0.254: v24.36,32.31 26.01,30.66 40.69,30.66 42.16,29.19 v46.08,29.19
  Bottom 0.254: v24.36,32.31 22.91,33.76 20.57,33.76 17.5,36.83 11.68,36.83 10.54,37.97 SV3.1 | v46.08,29.19 50.06,29.19 U5.37
DI_B
  Bottom 0.254: U5.12 17.75,49.25 7.72,49.25 6.86,48.39 6.86,39.24 6.35,38.73 SV3.3
DI_X
  Top 0.254: R2.1 21.18,25.65 19.3,25.65 17.91,27.05 13.97,27.05 12.95,28.07 12.95,29.97 12.06,30.86 12.06,36.07 11.05,37.08 8.51,37.08 8,37.59 SV3.2
DIO0  (via drill 0.33)
  Top 0.254: U3.12 23.24,9.6 33.53,19.89 35.53,19.89 U2.2 | v12.06,21.08 12.06,6.1 11.05,5.08 LORA_CON.1 | v14.22,26.04 13.26,26.04 R10.2
  Bottom 0.254: U3.12 23.24,7.57 22.05,8.76 7.62,8.76 6.48,7.62 6.48,6.1 5.46,5.08 LORA_CON.1 | v12.06,21.08 12.06,22.1 14.22,24.26 v14.22,26.04
DIO1
  Top 0.254: U3.13 25.24,9.83 33.39,17.97 U2.5
  Bottom 0.254: U3.13 23.46,9.32 6.53,9.32 5.08,7.87 LORA_CON.2
DIO2
  Top 0.254: U3.14 27.24,10.25 32.92,15.93 37.64,15.93 39.01,17.3 41.38,17.3 U2.9
  Bottom 0.254: U3.14 24.9,9.88 5.36,9.88 LORA_CON.3
DIO3
  Bottom 0.254: U3.15 26.35,10.44 7.34,10.44 LORA_CON.4
DIO4
  Bottom 0.254: U3.16 27.79,11 9.32,11 LORA_CON.5
DIO5  (via drill 0.25)
  Top 0.254: U5.9 25.63,52.09 6.25,52.09 5.38,51.23 5.38,49.33 3.35,47.3 3.35,18.62 4.19,17.78 LORA_CON.6 | v29.87,11.56 33.23,11.56 33.23,11.55 U3.19
  Bottom 0.254: v29.87,11.56 11.3,11.56 LORA_CON.6
DO  (via drill 0.25)
  Top 0.254: v24.84,25.48 R4.1
  Bottom 0.254: v24.84,25.48 32.05,25.48 33.22,26.65 33.22,29.52 U3.4
DO_A  (via drill 0.25)
  Top 0.254: v24.51,33.22 26.52,31.22 40.94,31.22 42.11,30.05 v45.52,30.05
  Bottom 0.254: v24.51,33.22 23.27,34.47 20.73,34.47 17.73,37.47 12.57,37.47 11.81,38.23 11.81,40.01 10.67,41.15 SV2.3 | v45.52,30.05 48.34,30.05 U5.33
DO_B
  Top 0.254: U5.13 16.59,50.8 15.14,49.35 13.11,49.35 12.09,48.34 7.95,48.34 6.86,47.24 6.86,41.91 6.48,41.53 SV2.1
DO_X  (via drill 0.25)
  Top 0.254: v25.76,18.92 27.21,18.92 U1.11 | v15.95,18.92 12.57,22.3 11.23,22.3 v11.18,22.35
  Bottom 0.254: v15.95,18.92 v25.76,18.92 | SV2.2 9.02,41.53 9.14,41.4 9.14,34.59 9.91,33.83 9.91,28.83 11.18,27.56 v11.18,22.35
EX_ANT
  Top 0.61: 44.6,42.82 46.86,42.82 | 46.86,42.82 GPS_ANT.P$5 | L5.1 46.74,42.95 46.86,42.82
  Top 0.762: 44.6,42.82 GPS.11
GND  (via drill 0.25)
  other vias: 28.75,19.08 34.04,18.87 35.1,14.5 39.12,19.18 28.8,18.06 29.16,20.96 23.37,12.67 24.89,4.34 2.13,2.92 6.48,4.39 13.23,7.9 9.75,7.57 7.77,6.55 4.11,24.89 10.34,49.89 31.29,41.43 20.98,36.35 23.27,36.7 47.7,46.15 47.6,40.56 51.92,23.39 19.96,21.92 21.03,22.07 18.75,21.31 18.8,19.94 18.64,17.3 22.4,14 21.74,15.57 24.79,13.54 13.49,17.4 9.07,19.2 7.65,16.66 11.07,14.45 10.62,17.48 15.27,12.7 9.32,16.74 15.24,17.45 15.88,24.46 7.85,21.29 7.09,19.25 2.06,5.99 8.74,4.32 11.02,4.32 9.7,6.22 14.55,7.77 14.48,5.72 14.35,3.63 17.02,3.86 19.41,3.84 19.46,7.49 22.3,6.27 22.1,3.63 24.84,6.17 26.47,6.32 28.45,6.22 30.43,6.07 27.23,4.04 29.67,3.89 33.02,3.89 32.87,5.41 34.59,5.87 34.24,1.3 37.08,5.56 30.68,10.03 31.8,8.92 41.25,6.48 43.59,8.15 44.73,8.69 40.28,4.9 40.03,1.14 37.59,1.09 42.77,1.04 45.06,1.19 47.45,1.24 49.96,5.44 47.45,3.78 46.53,4.7 50.39,4.45 52.12,5.77 48.13,6.35 44.93,5.26 47.96,11.28 45.82,6.5 52.76,6.86 42.29,5.46 51.92,11.2 49.99,12.47 48.62,12.27 50.44,10.34 33.12,14.3 32.82,12.98 34.85,12.22 36.12,10.69 37.95,9.78 40.18,10.59 41.35,12.62 37.64,12.73 39.67,9.17 43.89,12.67 42.57,10.8 40.44,14.66 45.82,17.25 45.87,15.37 45.42,13.54 42.98,14.76 39.67,16.08 37.44,17.6 33.63,20.75 36.98,21.06 39.57,20.55 42.98,20.6 41.91,24.51 46.18,27.71 46.69,24.46 48.26,22.12 51,21.82 49.63,20.14 46.63,20.9 48.82,17.91 50.09,26.8 45.92,26.14 36.37,28.02 34.8,27.91 37.69,25.68 36.17,26.49 38.05,27.41 34.19,24.77 30.23,24.36 30.84,27.36 28.85,26.34 28.19,28.42 26.26,28.37 24.28,28.32 22.35,28.32 21.29,24.56 8,18.54 8.81,24.69 11,31.14 10.03,14.99 10.79,33.71 9.14,30.43 4.24,39.75 1.12,40.82 0.91,44.35 1.37,45.95 2.84,48.74 1.22,47.98 1.52,50.37 2.79,52.25 4.27,45.85 6.55,49.3 5.66,48.31 7.8,47.09 4.9,52.55 16.97,45.19 18.8,45.14 14.68,44.22 14.81,42.34 17.12,41.58 18.95,41.58 20.98,39.24 17.83,39.45 19.35,38.73 26.82,37.8 31.09,36.25 31.98,33.3 33.73,33.3 36.14,33.27 35.66,34.77 34.54,36.04 33.27,37.52 31.45,37.52 32.41,35.48 38.76,36.25 37.69,37.97 26.82,40.51 32.05,40.06 34.65,40.61 35.56,38.68 33.32,42.7 37.54,45.09 36.35,47.14 36.02,44.78 39.12,42.85 39.5,47.32 44.86,47.14 41.66,41.22 39.67,41.43 42.52,37.87 44.86,36.3 52.53,39.09 49.23,38.94 51.82,32.49 28.85,52.25 32.26,52.1 34.95,52.1 37.29,52.1 39.98,52.1 42.52,52.1 45.06,52.04 47.35,52.04 50.24,52.25 48.23,49.25 50.62,48.13 51.51,50.42 52.17,48.54 26.97,43.1 1.93,42.85 2.62,39.85 10.54,35.2 9.98,21.26 9.98,24 5.89,2.49 0.86,2.84 10.74,19.13 22.76,19.69 20.17,18.11 20.02,20.29 20.17,17.25 24.49,17.86 24.33,20.09 22.99,31.39 24.84,36.25 29.36,41.58 26.42,22.07 31.04,20.04 12.8,47.22 10.49,46.43 51.97,35.94 46.74,41.12 27.25,26.34 15.24,15.42 15.37,25.83 14.1,22.53 14.99,21.39 15.62,22.02 12.65,45.75 11.89,45.11 13.28,39.52 13.16,41.05 14.05,48.29 17.6,42.7 10.62,42.95 20.45,12.93 13.21,6.35 10.97,6.99
  pour Top: -0.38,53.47 54.48,53.72 54.23,-0.38 -0.13,-0.38 -0.38,52.45
  pour Bottom: -0.28,53.49 -0.53,-0.43 53.54,-0.56 54.08,-0.53 54.48,53.49 48.84,53.52
N$1  (via drill 0.25)
  Top 0.254: U5.3 40.79,47.9 v40.79,35.69 | v40.79,29.29 40.79,22.63 40.23,22.07 R5.1
  Bottom 0.254: v40.79,35.69 v40.79,29.29
N$2  (via drill 0.25)
  Top 0.254: U1.12 26.27,19.52 v25.91,19.89 | v24.33,22.33 24.84,22.84 R4.2
  Bottom 0.254: v25.91,19.89 24.33,21.46 v24.33,22.33
N$3
  Top 0.254: U1.5 22.36,18.22 23.57,19.43 23.57,23.24 R3.2
N$4
  Top 0.254: R2.2 22.55,20.5 22.25,20.19 21.43,20.19 U1.2
N$5
  Top 0.254: R1.2 26.01,23.34 26.01,23.14 25.04,22.17 25.04,18.62 26.09,17.57 U1.9
N$6
  Top 0.254: PWR.A 6.78,23.5 R6.2
N$7
  Top 0.254: R7.1 39.55,23.17 39.12,22.73 37.54,22.73 36.58,21.77 30.84,21.77 27.63,24.97 27.18,24.97 24.54,27.61 21.69,27.61 19.2,30.1 19.2,36.25 13.61,41.83 13.61,44.68 17.7,48.77 20.83,48.77 21.46,49.4 23.11,49.4 24.38,50.67 U5.10
N$8
  Top 0.254: R9.2 6.29,28.91 3D_FIX.A
N$9
  Top 0.254: T2.1 8.94,29.54 8.51,29.97 5.21,29.97 4.45,29.21 4.45,28.59 3D_FIX.C
N$10
  Top 0.254: R10.1 R11.1 12.03,24.91 T1.3
N$11
  Top 0.406: U2.12 43.01,19.27 R13.2
N$12
  Top 0.254: R14.2 R15.2 R16.2 17.63,30.76 21.84,26.54 24.89,26.54 25.98,25.45 R1.1
N$13
  Top 0.305: R17.2 EXT_ANT.A
N$15
  Top 0.406: R19.2 L5.2
N$60  (via drill 0.33)
  Top 0.254: R12.2 7.82,26.75 8.13,27.05 v8.64,27.05
  Top 0.305: RX.C 4.46,26.94 v4.57,27.05
  Bottom 0.254: v4.57,27.05 v8.64,27.05
PD6  (via drill 0.25)
  Top 0.254: v33.88,17.3 35.53,17.3 U2.6 | v32.26,26.7 v32.26,22.53
  Bottom 0.254: J_DIO1.2 32.26,30.23 v32.26,26.7 | v33.88,17.3 32.26,18.92 v32.26,22.53
PD7  (via drill 0.25)
  Top 0.254: J_DIO2.2 26.42,38.99 33.53,38.99 38.28,34.24 v41.81,34.24 | v42.88,16.64 41.42,16.64 U2.8
  Bottom 0.254: v41.81,34.24 41.81,26.06 43.94,23.93 43.94,17.7 v42.88,16.64
RESET
  Top 0.254: U3.5 37.13,23.65 R8.1 R7.2
  Bottom 0.254: U3.5 29.06,27.36 22.81,27.36 17.03,21.58 16.92,21.46 15.77,20.32 LORA_CON.7
RST
  Top 0.305: GPS.10 46.38,40.26 48.77,37.87 GPS_CON.4 50.04,38.48 51.97,38.48 52.73,37.72 52.73,19.18 37.44,3.89 34.85,3.89 32.21,1.25 12.14,1.25 10.77,2.62 RST.P$1
RX
  Bottom 0.254: U5.1 46.41,48.44 32.97,48.44 31.75,47.22 27.84,47.22 24.77,44.15 GPS_TX.3
RXD  (via drill 0.25)
  Top 0.254: GPS_RX.2 23.72,44.98 25.55,44.98 26.47,44.07 30.94,44.07 v31.45,44.07 | R13.1 43.94,27.96 v43.69,28.22
  Top 0.305: GPS_RX.2 GPS_RX.1
  Bottom 0.254: v43.69,28.22 43.69,34.11 33.73,44.07 v31.45,44.07
RXD1  (via drill 0.25)
  Top 0.254: GPS.1 v31.23,45.35 v31.24,45.34 | U2.11 41.51,18.52 45.16,18.52 v45.26,18.62
  Bottom 0.254: v31.24,45.34 33.68,45.34 44.55,34.47 44.55,23.55 45.26,22.84 v45.26,18.62
TIMER
  Top 0.305: GPS.7 46.74,32.65 GPS_CON.2
TX
  Bottom 0.254: U5.2 44.42,49 32.66,49 31.45,47.78 26.06,47.78 GPS_RX.3
TXD1
  Top 0.305: GPS_TX.1 GPS_TX.2 22.61,43.56 24.08,42.09 28.36,42.09 GPS.2

### Text on the board
tPlace: ICSP
tNames: LoRa/GPS Shield v1.3
tDocu: ADDET | RST | TIMER | 1PPS | RESET | DIO5 | DIO4 | DIO3 | DIO2 | DIO1 | DIO0